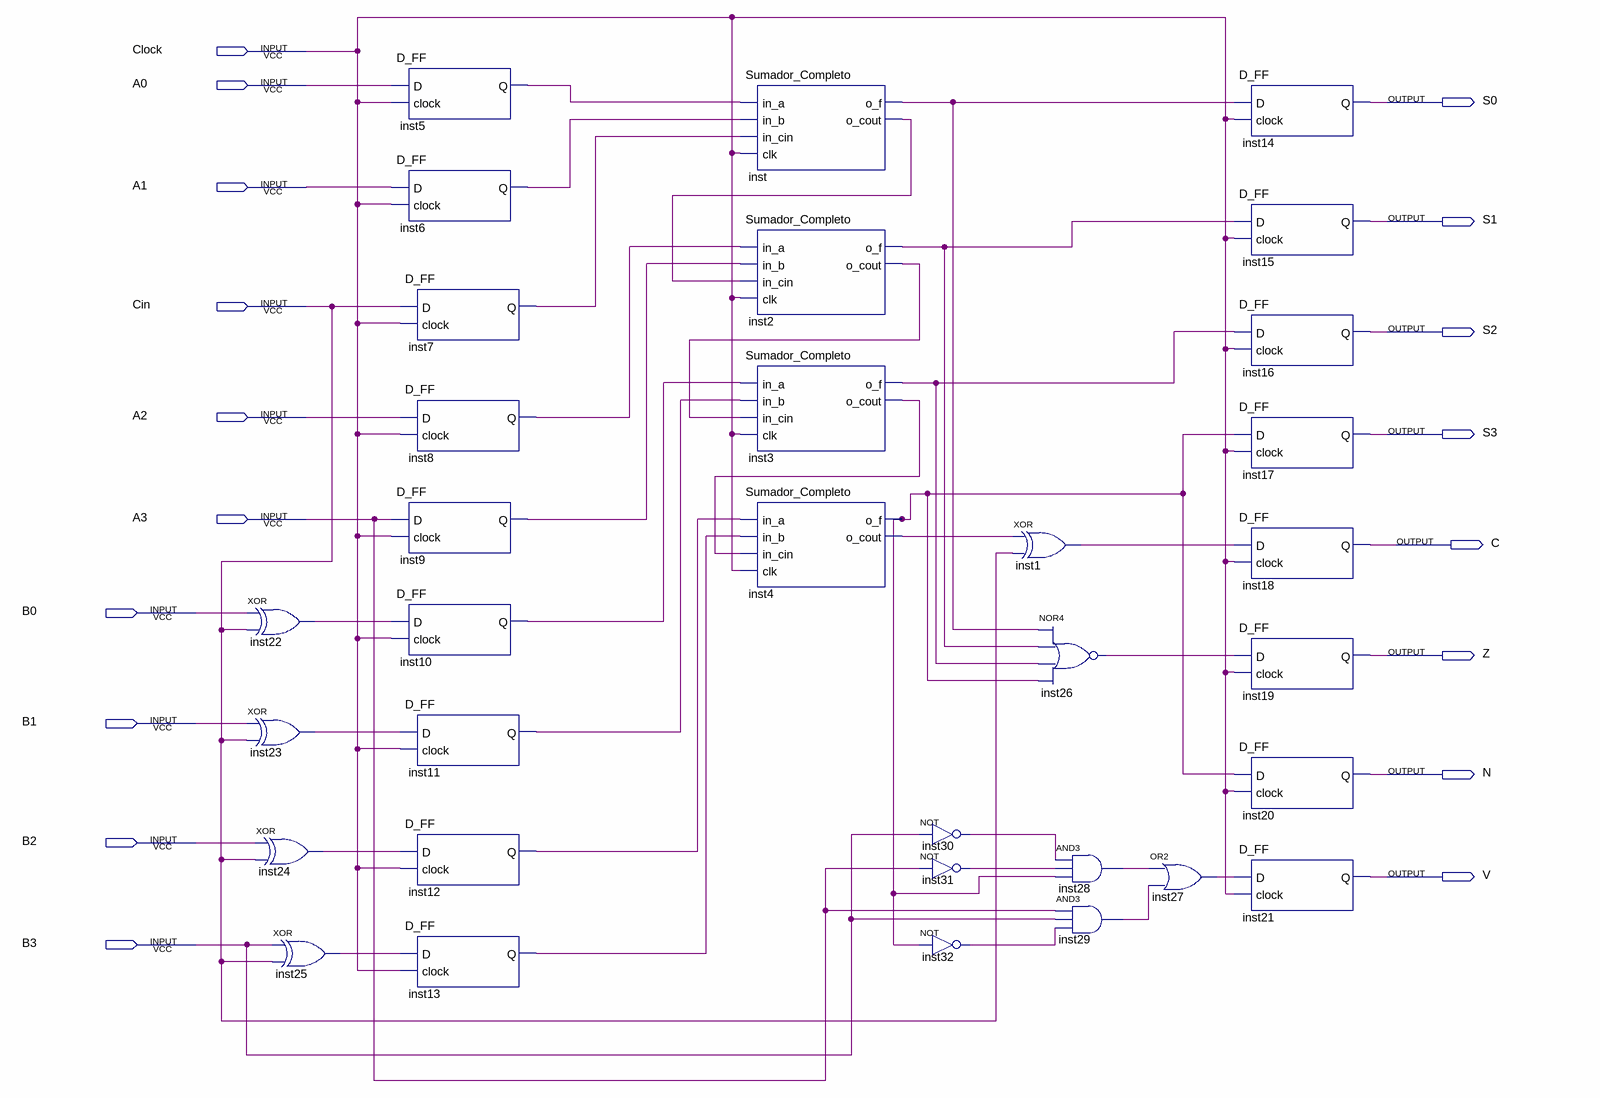
[diagram p0: schematic sheet]
// Quartus schematic ParteC.bdf as structural Verilog: 33 symbols, 18 pins
module ParteC (
  input  Clock,
  input  A0,
  input  A1,
  input  Cin,
  input  A2,
  input  A3,
  input  B0,
  input  B1,
  input  B2,
  input  B3,
  output S0,
  output S1,
  output S2,
  output S3,
  output C,
  output Z,
  output N,
  output V
);

  wire inst1_out, inst2_o_cout, inst2_o_f, inst3_o_cout, inst3_o_f, inst4_o_cout, inst4_o_f, inst5_q,
       inst6_q, inst7_q, inst8_q, inst9_q, inst10_q, inst11_q, inst12_q, inst13_q, inst22_out, inst23_out,
       inst24_out, inst25_out, inst26_out, inst27_out, inst28_out, inst29_out, inst30_out, inst31_out,
       inst32_out, inst_o_cout, inst_o_f;

  xor inst22 (inst22_out, B0, Cin);
  xor inst23 (inst23_out, B1, Cin);
  xor inst24 (inst24_out, B2, Cin);
  xor inst25 (inst25_out, B3, Cin);
  D_FF inst5 (.D(A0), .clock(Clock), .Q(inst5_q));
  D_FF inst6 (.D(A1), .clock(Clock), .Q(inst6_q));
  D_FF inst9 (.D(A3), .clock(Clock), .Q(inst9_q));
  D_FF inst10 (.D(inst22_out), .clock(Clock), .Q(inst10_q));
  D_FF inst7 (.D(Cin), .clock(Clock), .Q(inst7_q));
  D_FF inst8 (.D(A2), .clock(Clock), .Q(inst8_q));
  D_FF inst11 (.D(inst23_out), .clock(Clock), .Q(inst11_q));
  D_FF inst12 (.D(inst24_out), .clock(Clock), .Q(inst12_q));
  D_FF inst13 (.D(inst25_out), .clock(Clock), .Q(inst13_q));
  Sumador_Completo inst (
    .in_a(inst5_q), .in_b(inst6_q), .in_cin(inst7_q), .clk(Clock), .o_f(inst_o_f), .o_cout(inst_o_cout));
  Sumador_Completo inst2 (
    .in_a(inst8_q), .in_b(inst9_q), .in_cin(inst_o_cout), .clk(Clock), .o_f(inst2_o_f), .o_cout(inst2_o_cout));
  Sumador_Completo inst3 (
    .in_a(inst10_q), .in_b(inst11_q), .in_cin(inst2_o_cout), .clk(Clock), .o_f(inst3_o_f),
    .o_cout(inst3_o_cout));
  Sumador_Completo inst4 (
    .in_a(inst12_q), .in_b(inst13_q), .in_cin(inst3_o_cout), .clk(Clock), .o_f(inst4_o_f),
    .o_cout(inst4_o_cout));
  not inst30 (inst30_out, B3);
  not inst31 (inst31_out, A3);
  not inst32 (inst32_out, inst4_o_f);
  xor inst1 (inst1_out, inst4_o_cout, Cin);
  nor inst26 (inst26_out, inst_o_f, inst2_o_f, inst3_o_f, inst4_o_f);
  and inst28 (inst28_out, inst30_out, inst31_out, inst4_o_f);
  and inst29 (inst29_out, A3, B3, inst32_out);
  or inst27 (inst27_out, inst28_out, inst29_out);
  D_FF inst14 (.D(inst_o_f), .clock(Clock), .Q(S0));
  D_FF inst15 (.D(inst2_o_f), .clock(Clock), .Q(S1));
  D_FF inst16 (.D(inst3_o_f), .clock(Clock), .Q(S2));
  D_FF inst17 (.D(inst4_o_f), .clock(Clock), .Q(S3));
  D_FF inst18 (.D(inst1_out), .clock(Clock), .Q(C));
  D_FF inst19 (.D(inst26_out), .clock(Clock), .Q(Z));
  D_FF inst20 (.D(inst4_o_f), .clock(Clock), .Q(N));
  D_FF inst21 (.D(inst27_out), .clock(Clock), .Q(V));
endmodule
